# Altium schematic sheet Jlink OB.SchDoc
size A
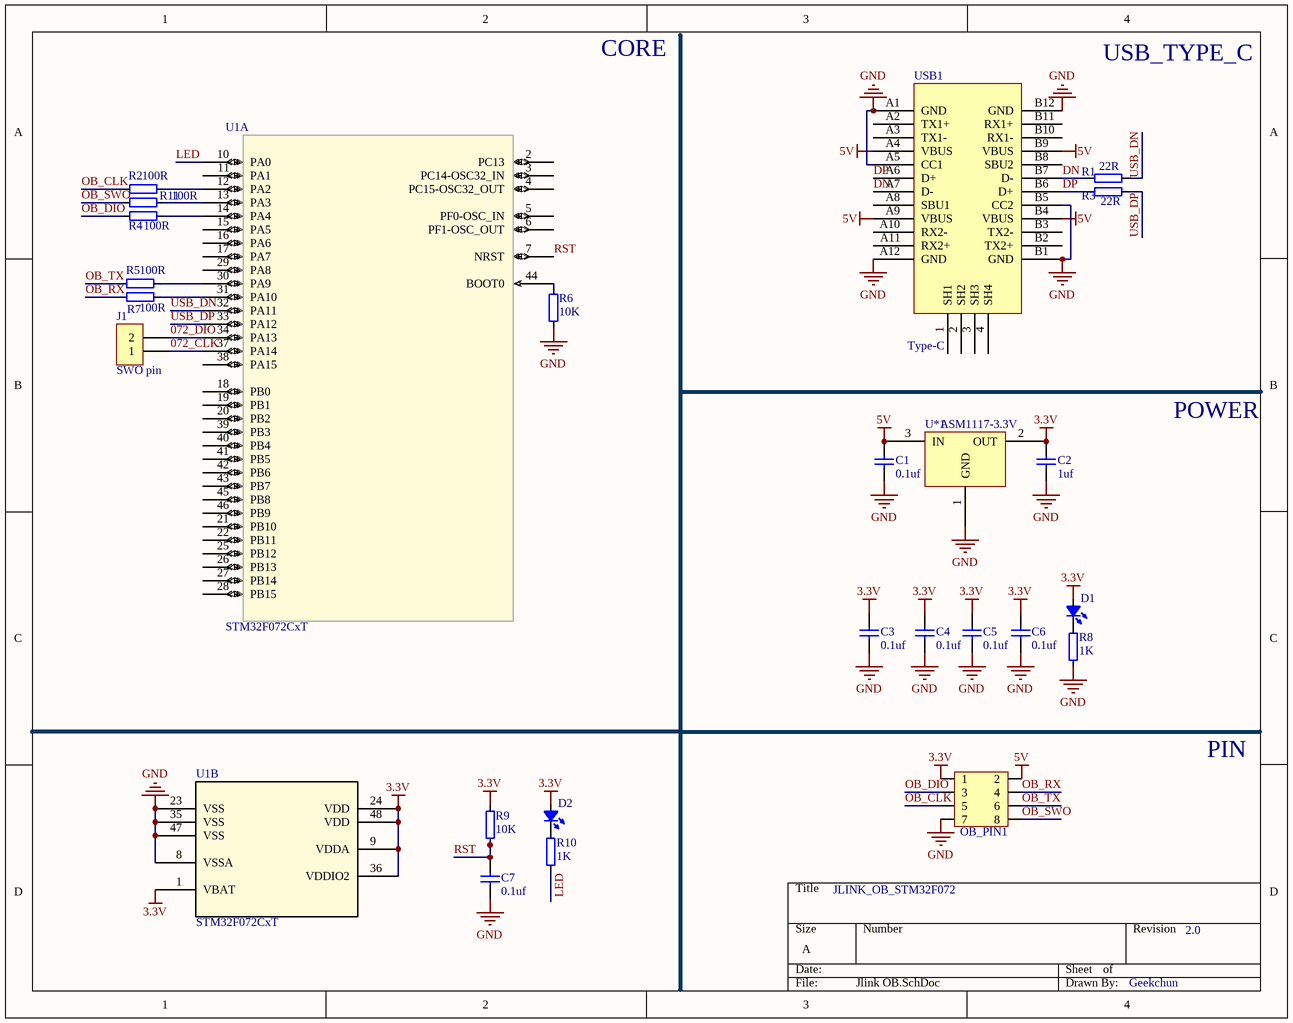
[diagram p0: Jlink OB.SchDoc]

## Parts
C1  0.1uf  [C 0603_L]
C2  1uf  [C 0603_L]
C3  0.1uf  [C 0603_L]
C4  0.1uf  [C 0603_L]
C5  0.1uf  [C 0603_L]
C6  0.1uf  [C 0603_L]
C7  0.1uf  [C 0603_L]
D1  LED_0603  [LED_0603_BLUE]  (value not drawn)
D2  LED_0603  [LED_0603_GREEN]  (value not drawn)
J1  SWO pin
OB_PIN1  HDR2x4_2.54  [HDR2X4_2.54_180H]  (value not drawn)
R1  22R  [R 0603_L]
R2  100R  [R 0603_L]
R3  22R  [R 0603_L]
R4  100R  [R 0603_L]
R5  100R  [R 0603_L]
R6  10K  [R 0603_L]
R7  100R  [R 0603_L]
R8  1K  [R 0603_L]
R9  10K  [R 0603_L]
R10  1K  [R 0603_L]
R11  100R  [R 0603_L]
U1  STM32F072CxT  [LQFP_P0.5_48]  (parts A,B of 2)
U*1  ASM1117-3.3V  [SOT-89]
USB1  Type-C  [PCBComponent_1]

## Nets
3.3V: C2.2 C3.2 C4.2 C5.2 C6.2 D1.1(A) D2.1(A) OB_PIN1.1 R9.2 U1.1(VBAT) U1.9(VDDA) U1.24(VDD) U1.36(VDDIO2) U1.48(VDD) U*1.2(OUT)
5V: C1.2 OB_PIN1.2 U*1.3(IN) USB1.A4(VBUS) USB1.A9(VBUS) USB1.B4(VBUS) USB1.B9(VBUS)
GND: C1.1 C2.1 C3.1 C4.1 C5.1 C6.1 C7.1 OB_PIN1.7 R6.2 R8.1 U1.8(VSSA) U1.23(VSS) U1.35(VSS) U1.47(VSS) U*1.1(GND) USB1.A1(GND) USB1.A5(CC1) USB1.A12(GND) USB1.B1(GND) USB1.B5(CC2) USB1.B12(GND)
072_CLK: J1.1 U1.37(PA14)
072_DIO: J1.2 U1.34(PA13)
DN: R1.1 USB1.A7(D-) USB1.B7(D-)
DP: R3.1 USB1.A6(D+) USB1.B6(D+)
LED: R10.1 U1.10(PA0)
OB_CLK: OB_PIN1.5 R2.1
OB_DIO: OB_PIN1.3 R4.1
OB_RX: OB_PIN1.4 R7.1
OB_SWO: OB_PIN1.8 R11.1
OB_TX: OB_PIN1.6 R5.1
RST: C7.2 R9.1 U1.7(NRST)
USB_DN: R1.2 U1.32(PA11)
USB_DP: R3.2 U1.33(PA12)
NetD1_2: D1.2(K) R8.2
NetD2_2: D2.2(K) R10.2
NetR2_2: R2.2 U1.12(PA2)
NetR4_2: R4.2 U1.14(PA4)
NetR5_2: R5.2 U1.30(PA9)
NetR6_1: R6.1 U1.44(BOOT0)
NetR7_2: R7.2 U1.31(PA10)
NetR11_2: R11.2 U1.13(PA3)

Not connected (* = marked no-connect by the designer): U1 2(PC13) 3(PC14-OSC32_IN) 4(PC15-OSC32_OUT) 5(PF0-OSC_IN) 6(PF1-OSC_OUT) 11(PA1) 15(PA5) 16(PA6) 17(PA7) 18(PB0) 19(PB1) 20(PB2) 21(PB10) 22(PB11) 25(PB12) 26(PB13) 27(PB14) 28(PB15) 29(PA8) 38(PA15) 39(PB3) 40(PB4) 41(PB5) 42(PB6) 43(PB7) 45(PB8) 46(PB9); USB1 1(SH1) 2(SH2) 3(SH3) 4(SH4) A2(TX1+) A3(TX1-) A8(SBU1) A10(RX2-) A11(RX2+) B2(TX2+) B3(TX2-) B8(SBU2) B10(RX1-) B11(RX1+)

## Notes on the sheet
- CORE
- USB_TYPE_C
- POWER
- PIN
- JLINK_OB_STM32F072
- 2.0
- Geekchun

## Library data of the parts
C1-C7 = CAP: Capacitor, NP0, ?.1pF; Part Number: C0402-1.2p; Value: 1.2pF; Note: 50V; Artikkelnr Noca: 20029157; Artikkelnr Simpro: N.A.; Manufacturer: *; Manufacturer Part Number: *; Datasheet: *; LatestRevisionDate: 2011-05-11; Pin Count: 2; Publisher: Nordic Semiconductor; Published: 2009-05-08; Supplier: *; Supplier part number: *; 2nd source Supplier: *; 2nd source part number: *; Footprint Doc: 0402
D1 D2 = LED_0603: LED
J1 = CON2: Connector
OB_PIN1 = HDR2x4_2.54: Header
R1-R11 = RES
U1 = STM32F072CxT: Imported; Vendor: STMicroelectronics; C: Copyright (C) 2016 Accelerated Designs. All rights reserved; Copyright: Copyright (C) 2016 Accelerated Designs. All rights reserved; Manufacturer_Part_Number: stm32f072cxt; RefDes: RefDes; Type: Type; Value: Value
U*1 = ASM1117-3.3V: 三端可调或固定电压3.3V